# EAGLE schematic pcb (EAGLE 9.5.2)
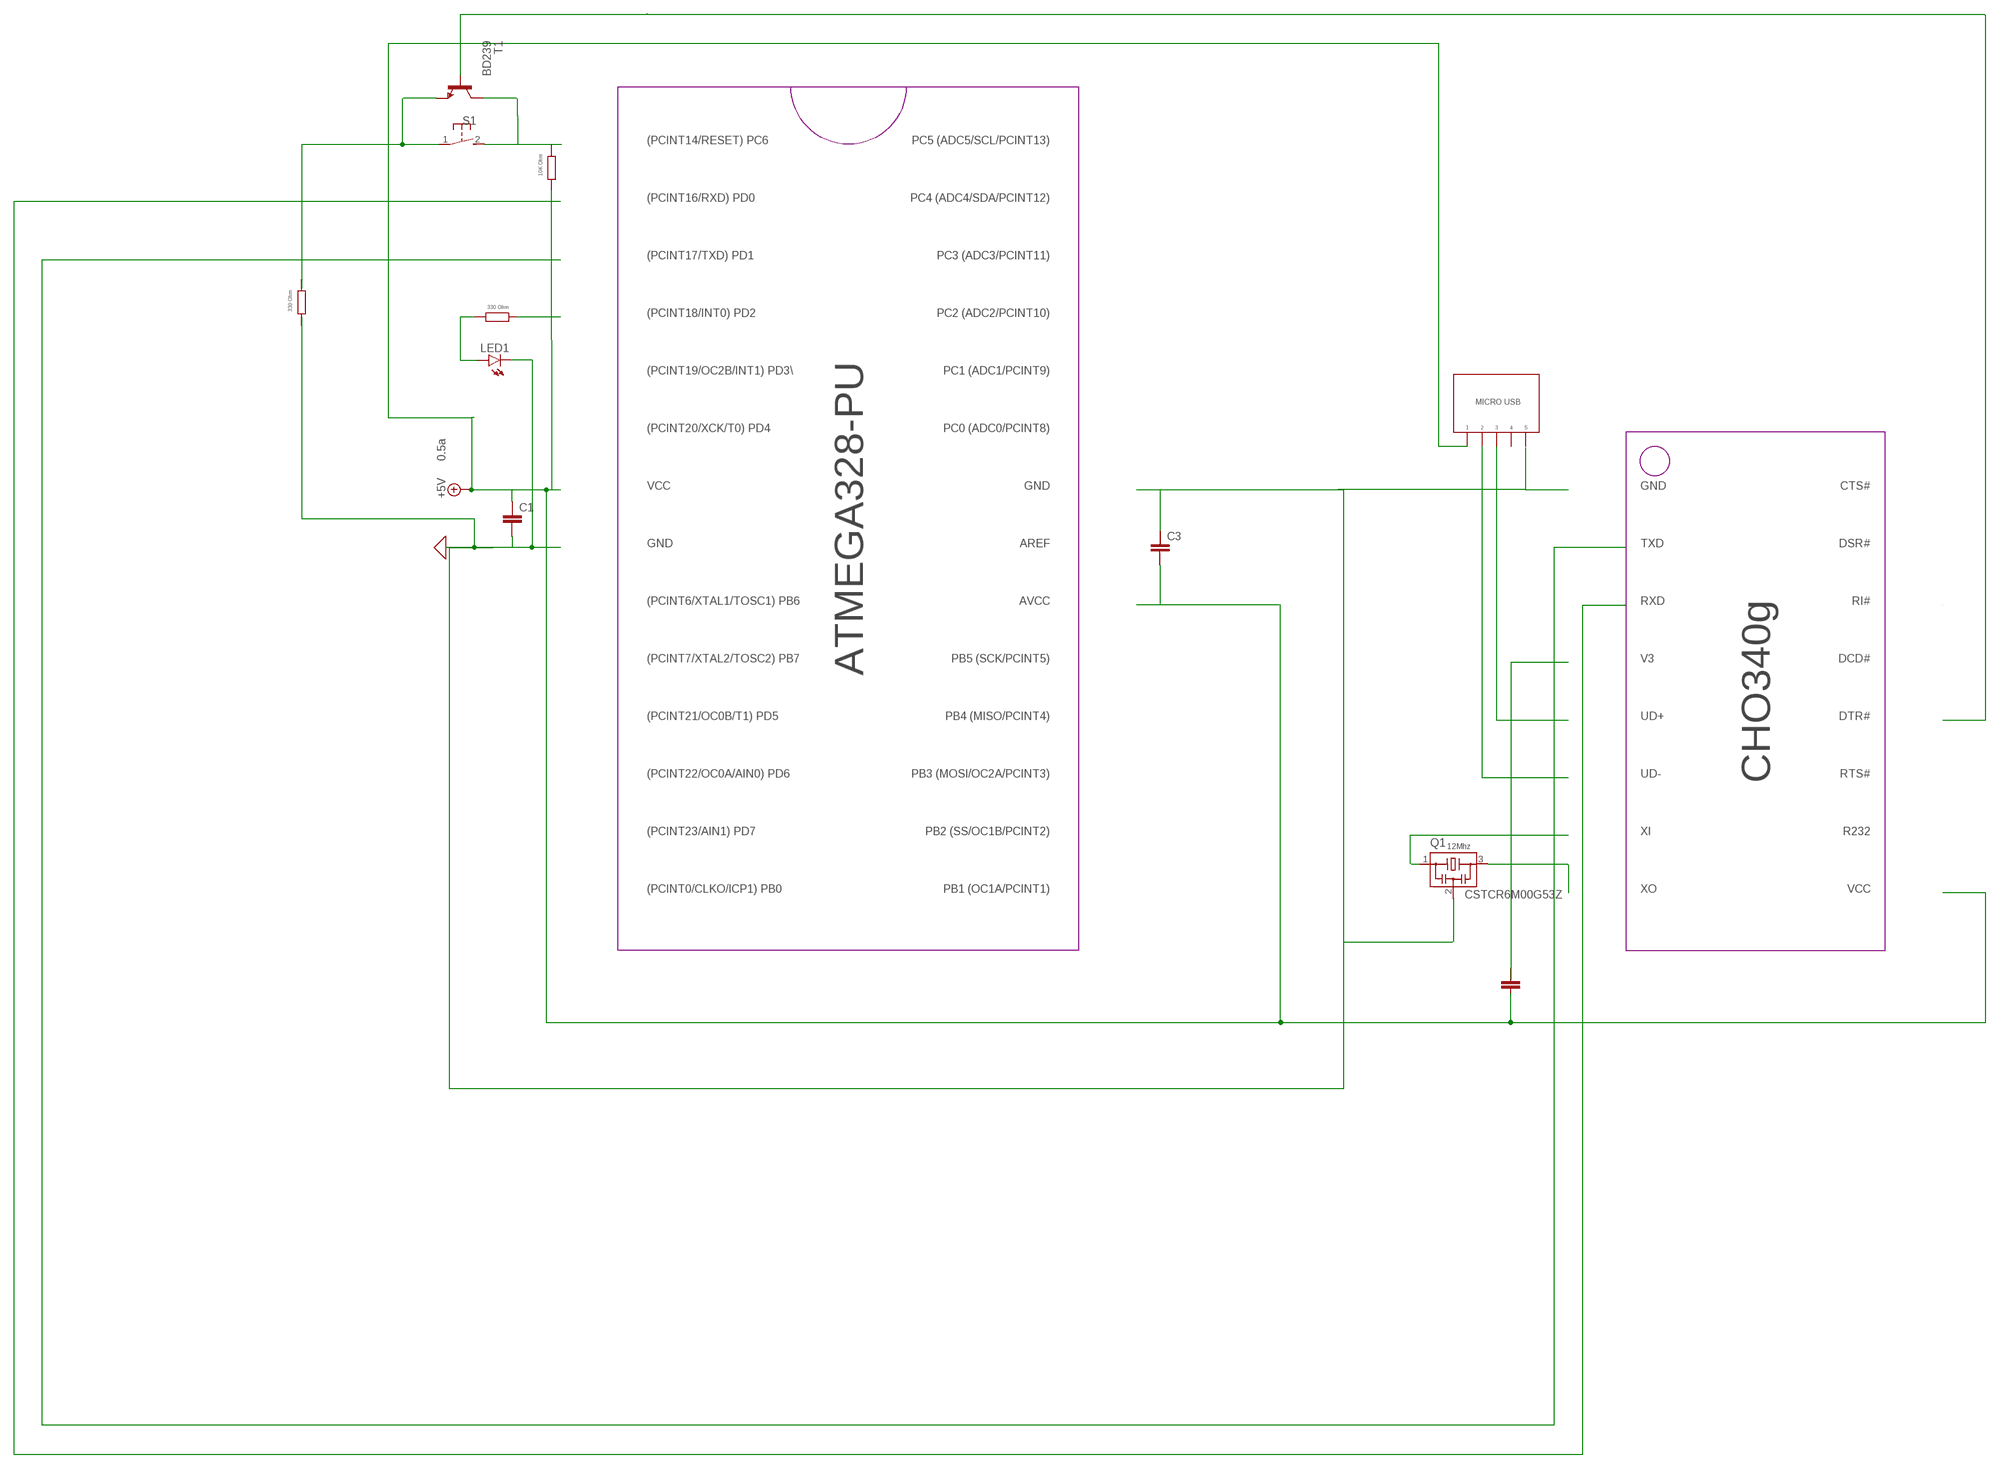
[diagram p0: schematic, sheet 1]

## Parts
C1  C2,5-3  [C2.5-3]
C3  C2,5-3  [C2.5-3]
LED1  LED  [SMARTLED-TTW]
Q1  CSTCR6M00G53Z  [CSTCR6M]
S1  31-XX  [B3F-31XX]
T1  BD239  [TO220]

## Nets
+5V: C3.2
N$1: C1.1
N$2: C1.2
N$3: S1.2(S)
N$4: C3.1
N$11: LED1.C@1(C)
N$13: LED1.A@1(A)
N$20: T1.1(B)
N$21: T1.2(C)
N$23: Q1.2
N$25: Q1.1
N$26: Q1.3
N$27: S1.1(P) T1.3(E)

## Notes on the sheet
- (PCINT14/RESET) PC6 | PC5 (ADC5/SCL/PCINT13)
- 10K Ohm
- (PCINT16/RXD) PD0 | PC4 (ADC4/SDA/PCINT12)
- (PCINT17/TXD) PD1 | PC3 (ADC3/PCINT11)
- 330 Ohm
- 330 Ohm
- (PCINT18/INT0) PD2 | PC2 (ADC2/PCINT10)
- (PCINT19/OC2B/INT1) PD3\ | PC1 (ADC1/PCINT9)
- MICRO USB
- 1 | 2 | 3 | 4 | 5
- (PCINT20/XCK/T0) PD4 | PC0 (ADC0/PCINT8)
- 0.5a
- VCC | GND | GND | CTS#
- ATMEGA328-PU
- GND | AREF | TXD | DSR#
- (PCINT6/XTAL1/TOSC1) PB6 | AVCC | RXD | RI#
- (PCINT7/XTAL2/TOSC2) PB7 | PB5 (SCK/PCINT5) | V3 | DCD#
- CHO340g
- (PCINT21/OC0B/T1) PD5 | PB4 (MISO/PCINT4) | UD+ | DTR#
- (PCINT22/OC0A/AIN0) PD6 | PB3 (MOSI/OC2A/PCINT3) | UD- | RTS#
- (PCINT23/AIN1) PD7 | PB2 (SS/OC1B/PCINT2) | XI | R232
- 12Mhz
- (PCINT0/CLKO/ICP1) PB0 | PB1 (OC1A/PCINT1) | XO | VCC

## Library data of the parts
C1 C3 = capacitor-wima:C: CAPACITOR naming: grid - package width
LED1 = led:LED: LED OSRAM: - CHIPLED LG R971, LG N971, LY N971, LG Q971, LY Q971, LO R971, LY R971 LH N974, LH R974 LS Q976, LO Q976, LY Q976 LO Q996 - Hyper CHIPLED LW Q18S LB Q993, LB Q99A, LB R99A - SideLED LS A670, LO A670, LY A670, LG A670, LP A670 LB A673, LV A673, LT A673, LW A673 LH A674 LY A675 LS A676, LA A676, LO A676, LY A676, LW A676 LS A679, LY A679, LG A679 - Hyper Micro SIDELED® LS Y876, LA Y876, LO Y876, LY Y876 LT Y87S - SmartLED LW L88C, LW L88S LB L89C, LB L89S, LG L890 LS L89K, LO L89K, LY L89K LS L896, LA L896, LO L896, LY L896 - TOPLED LS T670, LO T670, LY T670, LG T670, LP T670 LSG T670, LSP T670, LSY T670, LOP T670, LYG T670 LG T671, LOG T671, LSG T671 LB T673, LV T673, LT T673, LW T673 LH T674 LS T676, LA T676, LO T676, LY T676, LB T676, LH T676, LSB T676, LW T676 LB T67C, LV T67C, LT T67C, LS T67K, LO T67K, LY T67K, LW E67C LS E67B, LA E67B, LO E67B, LY E67B, LB E67C, LV E67C, LT E67C LW T67C LS T679, LY T679, LG T679 LS T770, LO T770, LY T770, LG T770, LP T770 LB T773, LV T773, LT T773, LW T773 LH T774 LS E675, LA E675, LY E675, LS T675 LS T776, LA T776, LO T776, LY T776, LB T776 LHGB T686 LT T68C, LB T68C - Hyper Mini TOPLED® LB M676 - Mini TOPLED Santana® LG M470 LS M47K, LO M47K, LY M47K Source: http://www.osram.convergy.de LUXEON: - LUMILED® LXK2-PW12-R00, LXK2-PW12-S00, LXK2-PW14-U00, LXK2-PW14-V00 LXK2-PM12-R00, LXK2-PM12-S00, LXK2-PM14-U00 LXK2-PE12-Q00, LXK2-PE12-R00, LXK2-PE12-S00, LXK2-PE14-T00, LXK2-PE14-U00 LXK2-PB12-K00, LXK2-PB12-L00, LXK2-PB12-M00, LXK2-PB14-N00, LXK2-PB14-P00, LXK2-PB14-Q00 LXK2-PR12-L00, LXK2-PR12-M00, LXK2-PR14-Q00, LXK2-PR14-R00 LXK2-PD12-Q00, LXK2-PD12-R00, LXK2-PD12-S00 LXK2-PH12-R00, LXK2-PH12-S00 LXK2-PL12-P00, LXK2-PL12-Q00, LXK2-PL12-R00 Source: www.luxeon.com KINGBRIGHT: KA-3528ASYC Source: www.kingbright.com
Q1 = murata-filter:CSTCR: Resonator Source: murata.co.jp; MPN: CSTCR6M00G53-R0; OC_FARNELL: 1170434; OC_NEWARK: 25M8759
S1 = switch-omron:31-XX: OMRON SWITCH; MPN: B3F-3100; OC_FARNELL: 959704; OC_NEWARK: 36M3582
T1 = transistor-neu-to92:BD239: NPN TRANSISTOR Source: http://www.fairchildsemi.com/ds/BD/BD239C.pdf

## Module ATMEGA328PU
Ports: PB1(OC1A/PCINT1)(io)

### Library data of the parts